# Altium schematic sheet main.SchDoc
size A4; SheetNumber: 1; SheetTotal: 1
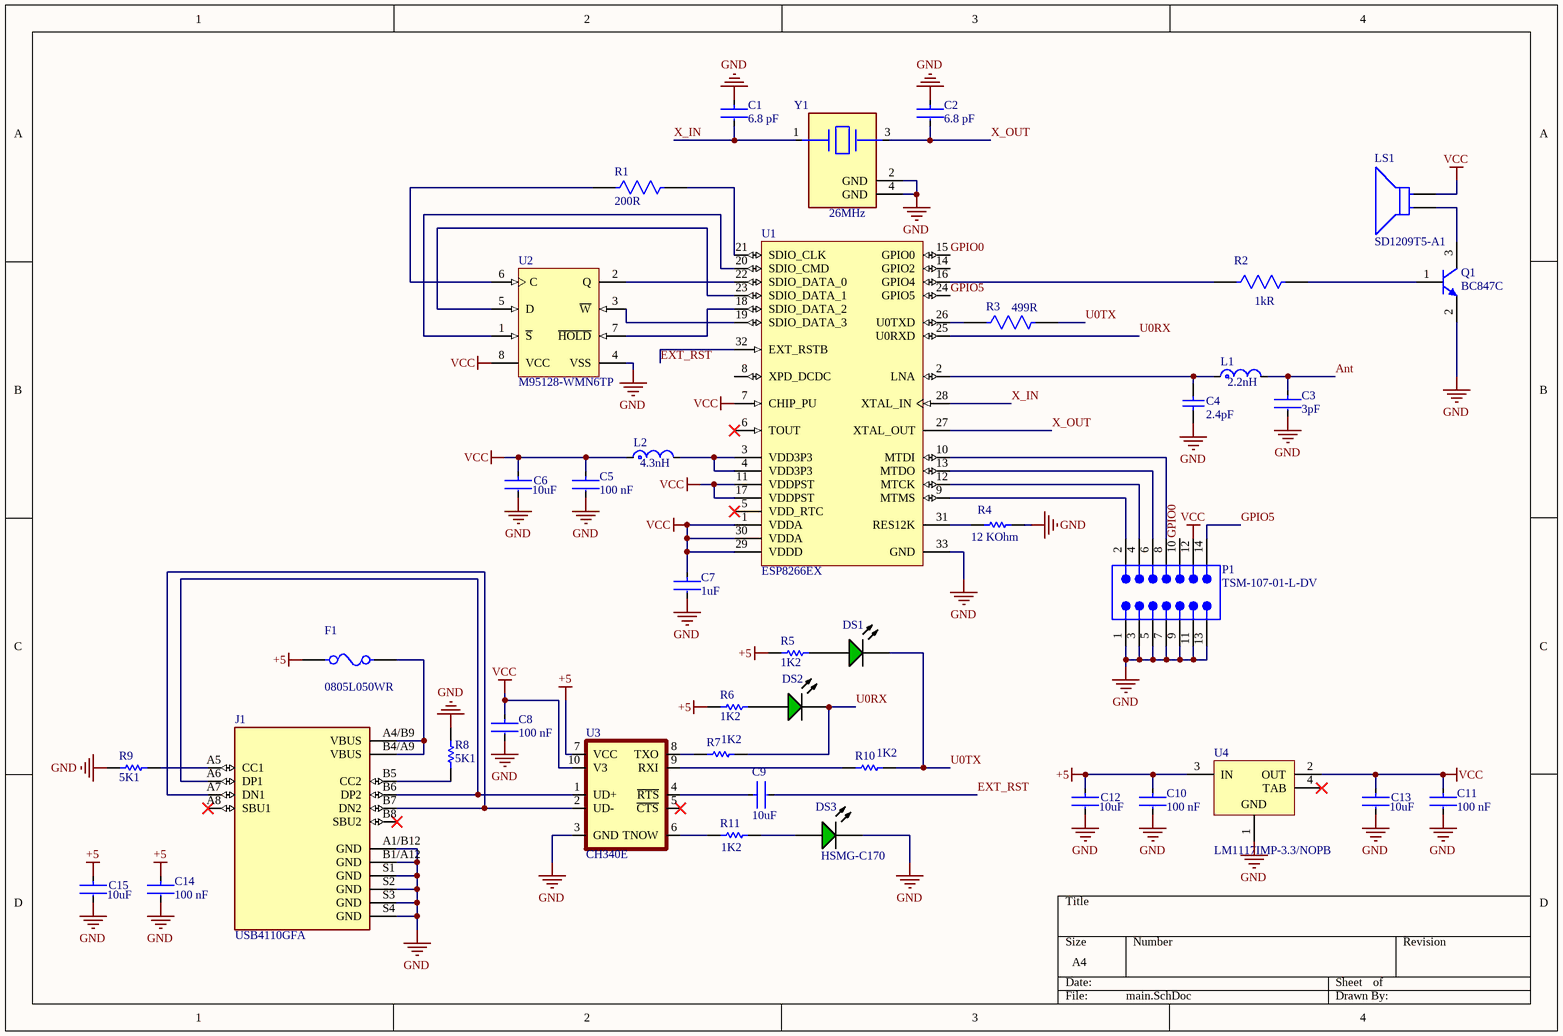
[diagram p0: main.SchDoc]

## Parts
C1  Capacitance: 6.8 pF  [FP-C0402-BB-MFG]  (hidden comment: C0402C689C5GACTU)
C2  Capacitance: 6.8 pF  [FP-C0402-BB-MFG]  (hidden comment: C0402C689C5GACTU)
C3  Capacitance: 3pF  [FP-GJM155-0_05-IPC_C]  (hidden comment: GJM1555C1H3R0BB01D)
C4  2.4pF  [CAPC1006X50X20ML10T10]
C5  value 100 nF  [FP-CC0402-MFG]  (hidden comment: CC0402KRX7R9BB104)
C6  Capacitance: 10uF  [FP-C1608-080-0_1-MFG]  (hidden comment: C1608X5R1A106K080AC)
C7  value 1uF  [FP-GRM15-0_1-MFG]  (hidden comment: GRM155R61A105KE15D)
C8  value 100 nF  [FP-CC0402-MFG]  (hidden comment: CC0402KRX7R9BB104)
C9  Capacitance: 10uF  [FP-C1608-080-0_1-MFG]  (hidden comment: C1608X5R1A106K080AC)
C10  value 100 nF  [FP-CC0402-MFG]  (hidden comment: CC0402KRX7R9BB104)
C11  value 100 nF  [FP-CC0402-MFG]  (hidden comment: CC0402KRX7R9BB104)
C12  Capacitance: 10uF  [FP-C1608-080-0_1-MFG]  (hidden comment: C1608X5R1A106K080AC)
C13  Capacitance: 10uF  [FP-C1608-080-0_1-MFG]  (hidden comment: C1608X5R1A106K080AC)
C14  value 100 nF  [FP-CC0402-MFG]  (hidden comment: CC0402KRX7R9BB104)
C15  Capacitance: 10uF  [FP-C1608-080-0_1-MFG]  (hidden comment: C1608X5R1A106K080AC)
DS1  HSMG-C170  [AVAG-HSMX-C170_V]  (value not drawn)
DS2  HSMG-C170  [AVAG-HSMX-C170_V]  (value not drawn)
DS3  HSMG-C170  [AVAG-HSMX-C170_V]
F1  0805L050WR  [FP-0805L-MFG]
J1  USB4110GFA  [GCT_USB4110GFA]
L1  Inductance: 2.2nH  [FP-LQG15HH_02-IPC_C]  (hidden comment: LQG15HN2N2S02D)
L2  Inductance: 4.3nH  [FP-LQG15HH_02-MFG]  (hidden comment: LQG15HN4N3S02D)
LS1  SD1209T5-A1  [FP-SD1209-MFG]
P1  TSM-107-01-L-DV  [SMTC-TSM-107-01-X-DV]
Q1  BC847C  [INF-SOT23_L]
R1  Resistance: 200R  [FP-CRCW0402-e3-IPC_C]  (hidden comment: CRCW0402200RFKED)
R2  Resistance: 1kR  [FP-ERA3A-IPC_C]  (hidden comment: ERA-3AEB102V)
R3  Resistance: 499R  [FP-RC0402-0_4-IPC_A]  (hidden comment: RC0402FR-07499RL)
R4  Resistance: 12 KOhm  [RESC1005X40X25ML05T05]  (hidden comment: ERJ-2RKF1202X)
R5  1K2  [RESC1005X40X25NL05T05]
R6  1K2  [RESC1005X40X25NL05T05]
R7  1K2  [RESC1005X40X25NL05T05]
R8  5K1  [RESC1608X55X25ML10T15]
R9  5K1  [RESC1608X55X25ML10T15]
R10  1K2  [RESC1005X40X25NL05T05]
R11  1K2  [RESC1005X40X25NL05T05]
U1  ESP8266EX  [ESFS-QFN-32_L]
U2  M95128-WMN6TP  [STM-SO8N-8_V]
U3  CH340E  [MSOP10]
U4  LM1117IMP-3.3/NOPB  [DCY0004A_N]
Y1  Frequency: 26MHz  [FP-ABM11-MFG]  (hidden comment: ABM11-26.000MHZ-B7G-T)

## Nets
+5: C10.1 C12.2 C14.1 C15.2 F1.1 R5.2 R6.2 U3.7(VCC) U4.3(IN)
GND: C1.1 C2.1 C3.2 C4.2 C5.2 C6.1 C7.2 C8.2 C10.2 C11.2 C12.1 C13.1 C14.2 C15.1 DS3.2(K) J1.A1/B12(GND) J1.B1/A12(GND) J1.S1(GND) J1.S2(GND) J1.S3(GND) J1.S4(GND) P1.1 P1.3 P1.5 P1.7 P1.9 P1.11 P1.13 Q1.2(E) R4.2 R8.2 R9.1 U1.33(GND) U2.4(VSS) U3.3(GND) U4.1(GND) Y1.2(GND) Y1.4(GND)
VCC: C5.1 C6.2 C7.1 C8.1 C11.1 C13.2 L2.1 LS1.2(A) P1.12 U1.1(VDDA) U1.7(CHIP_PU) U1.11(VDDPST) U1.17(VDDPST) U1.29(VDDD) U1.30(VDDA) U2.8(VCC) U3.10(V3) U4.2(OUT)
Ant: C3.1 L1.2
EXT_RST: C9.1 U1.32(EXT_RSTB)
GPIO0: P1.10 U1.15(GPIO0)
GPIO5: P1.14 U1.24(GPIO5)
U0RX: DS2.2(K) R7.2 U1.25(U0RXD)
U0TX: DS1.2(K) R3.2 R10.2
X_IN: C1.2 U1.28(XTAL_IN) Y1.1
X_OUT: C2.2 U1.27(XTAL_OUT) Y1.3
NetC4_1: C4.1 L1.1 U1.2(LNA)
NetC9_2: C9.2 U3.4(~{RTS})
NetDS1_1: DS1.1(A) R5.1
NetDS2_1: DS2.1(A) R6.1
NetDS3_1: DS3.1(A) R11.2
NetF1_2: F1.2 J1.A4/B9(VBUS) J1.B4/A9(VBUS)
NetJ1_A5: J1.A5(CC1) R9.2
NetJ1_A6: J1.A6(DP1) J1.B6(DP2) U3.1(UD+)
NetJ1_A7: J1.A7(DN1) J1.B7(DN2) U3.2(UD-)
NetJ1_B5: J1.B5(CC2) R8.1
NetL2_2: L2.2 U1.3(VDD3P3) U1.4(VDD3P3)
NetLS1_1: LS1.1(C) Q1.3(C)
NetP1_2: P1.2 U1.9(MTMS)
NetP1_4: P1.4 U1.12(MTCK)
NetP1_6: P1.6 U1.13(MTDO)
NetP1_8: P1.8 U1.10(MTDI)
NetQ1_1: Q1.1(B) R2.2
NetR1_1: R1.1 U2.6(C)
NetR1_2: R1.2 U1.21(SDIO_CLK)
NetR2_1: R2.1 U1.16(GPIO4)
NetR3_1: R3.1 U1.26(U0TXD)
NetR4_1: R4.1 U1.31(RES12K)
NetR7_1: R7.1 U3.8(TXO)
NetR10_1: R10.1 U3.9(RXI)
NetR11_1: R11.1 U3.6(TNOW)
NetU1_18: U1.18(SDIO_DATA_2) U2.7(~{HOLD})
NetU1_19: U1.19(SDIO_DATA_3) U2.3(~{W})
NetU1_20: U1.20(SDIO_CMD) U2.1(~{S})
NetU1_22: U1.22(SDIO_DATA_0) U2.2(Q)
NetU1_23: U1.23(SDIO_DATA_1) U2.5(D)

Not connected (* = marked no-connect by the designer): J1 A8(SBU1)* B8(SBU2)*; U1 5(VDD_RTC)* 6(TOUT)* 8(XPD_DCDC) 14(GPIO2); U3 5(~{CTS})*; U4 4(TAB)*

## Library data of the parts
C1 C2 = CMP-1034-00517-3: CAP CER 6.8PF 50V NP0 0402; Manufacturer: Kemet; Material: Ceramic; Temperature Characteristic: C0G; Tolerance: 0.25 pF; Temperature Coefficient: 15%; ComponentLink2URL: https://content.kemet.com/datasheets/KEM_C1002_X7R_SMD.pdf; Octopart: https://octopart.com/c0402c689c5gactu-kemet-9143567; RoHS: TRUE; Temperature: -55°C to +125°C; Device Class L2: Capacitors; ComponentLink2Description: Datasheet; Mouser Description: Cap Ceramic 6.8pF 50V C0G 0.25pF SMD 0402 125°C Paper T/R; Device Class L3: Ceramic Capacitors; Digikey Description: CAP CER 6.8PF 50V NP0 0402; Temperature Range High: +125°C; Package: C0402-BB; Voltage Rating: 50 V; Height: 0.55mm; Ipc Land Pattern Name: CAPC10050X50; Value: 6.8 pF; Device Class L1: Passive Components; Category: Cap; Manufacturer Part Number: C0402C689C5GACTU; Lead Free: Yes; Automotive: No; Temperature Range Low: -55°C
C3 = CMP-2008-03843-2: Multi-Layer Ceramic Capacitor 3pF C0G  ±0.1pF 0402 Paper T/R; Voltage Rating: 50V; Termination: SMD/SMT; Package Quantity: 1; Packaging: Tape and Reel; REACH SVHC: No SVHC; Case Code (Metric): 1005; Dielectric: C0G; Voltage: 50V; Max Operating Temperature: 125°C; Depth: 0.5mm; Min Operating Temperature: -55°C; Case/Package: 0402; Lead Free: Lead Free; Width: 0.02inch; Thickness: 0.022inch; Radiation Hardening: No; Length: 1mm; Height: 0.5mm; Voltage Rating (DC): 50V; Mount: Surface Mount; Case Code (Imperial): 0402
C4 = CMP-2008-04784-1: Part Number: 04023J2R4BBSTR; Manufacturer: AVX Interconnect / Elco
C5 C8 C10 C11 C14 = CMP-03422-001010-1: CAP CER 0.1UF 50V X7R 0402; Manufacturer: YAGEO; Temperature Coefficient: 30ppm/°C; Material: Ceramic; Automotive Grade: NA; Tolerance: 0.1; Footprint Url: http://www.yageo.com/exep/pages/download/literatures/UPY-C_GEN_24.pdf; Category: Cap; Capacitance: 100 nF; Package: CC0402; Voltage Rating: 50 V; ComponentLink2Description: Datasheet; Temperature Characteristic: X7R; Device Class L1: Passive Components; Device Class L2: Capacitors; Digikey Description: CAP CER 0.1UF 50V X7R 0402; Octopart: https://octopart.com/cc0402krx7r9bb104-yageo-56536067; Device Class L3: Ceramic Capacitors; Height: 0.55mm; Temperature: -55°C to +125°C; Temperature Range High: +125°C; ComponentLink2URL: http://www.yageo.com/documents/recent/UPY-GP_NP0_16V-to-50V_16.pdf; Temperature Range Low: -55°C; RoHS: TRUE; Ipc Land Pattern Name: CAPC10050X50; Lead Free: Yes; Automotive: No; Manufacturer Part Number: CC0402KRX7R9BB104
C6 C9 C12 C13 C15 = CMP-2000-04979-3: Multilayer Ceramic Capacitors 10μF ±10% 10V X5R SMD 0603; Dielectric Material: Ceramic; Construction: Flat; Height: 0.8mm; Thickness: 0.035inch; Case Code (Metric): 1608; Radiation Hardening: No; Number of Pins: 2; Voltage Rating (DC): 10V; Depth: 0.8mm; Voltage: 10V; RoHS Compliant: Yes; Voltage Rating: 10V; Package Quantity: 1; Resistor Type: Ceramic; Termination: SMD/SMT; Lead Free: Lead Free; REACH SVHC: No SVHC; Tolerance: 10%; Mount: Surface Mount; Series: C; Packaging: Tape and Reel; Width: 0.8mm; Dielectric: X5R; Weight: 7.1E-05oz; Length: 1.6mm; Max Operating Temperature: 85°C; Case Code (Imperial): 0603; Case/Package: 0603; Min Operating Temperature: -55°C
C7 = CMP-2008-04556-2: CAP CER 1UF 10V X5R 0402; Manufacturer: Murata; Material: Ceramic; Tolerance: 10%; Temperature Coefficient: 15%; Octopart: https://octopart.com/grm155r61a105ke15d-murata-197442; Manufacturer Part Number: GRM155R61A105KE15D; Lead Free: Yes; ComponentLink2Description: Datasheet; Temperature: -55°C to +85°C; Temperature Range High: +85°C; Height: 0.55mm; Capacitance: 1uF; Ipc Land Pattern Name: CAPC10050X50; ComponentLink2URL: https://search.murata.co.jp/Ceramy/image/img/A01X/G101/ENG/GRM155R61A105KE15-01A.pdf; Temperature Range Low: -55°C; Device Class L2: Capacitors; Voltage Rating: 10V; RoHS: TRUE; Device Class L1: Passive Components; Device Class L3: Ceramic Capacitors; Temperature Characteristic: X5R; Mouser Description: 0402 1 uF 10 V ±10% Tolerance X5R Surface Mount Multilayer Ceramic Capacitor; Automotive: No; Package: GRM15-0.1; Digikey Description: CAP CER 1UF 10V X5R 0402; Category: Cap
DS1-DS3 = CMP-2000-05062-1: Chip LED, Green, 2.2 V, -40 to 85 degC, 2-Pin SMD, Pb-Free, Tape and Reel; Manufacturer: Avago; No. of Pins: 2; Peak Wavelength: 570nm; SVHC: NoSVHC(16-Jun-2014); Dominant Wavelength: 572nm; Forward Current If: 20mA; Viewing Angle: 170deg; Lens Shape: Rectangular; PIV Max: 5V; External Width: 1.25mm; LED Type: Standard; External Depth: 0.8mm; Opto Mounting Orientation: Top; Luminous Intensity: 15mcd; Luminous Intensity Min: 4mcd; Forward Voltage VF Max: 2.6V; External Length / Height: 2mm; Bulb Size: 1.25mmx1.4mm; Light Area Height: 1mm; Voltage Vf Typ: 2.2V; Operating Temperature Max: 85degC; Datasheet Version: Oct-08; MSL: MSL2A-4weeks; Peak Forward Current: 20mA; Package Description: 2-Pin Surface Mount Device, Body 2 x 1.25 mm, Height 0.8 mm; Datasheet URL: https://datasheet.ciiva.com/29280/180495-da-01-en-chip-led-hsmg-c170-gelb-gruen-29280971.pdf; Storage Temperature Min: -40degC; LED Colour: Green; Wavelength Typ: 570nm; Mounting Type: SMD; Forward Current If Max: 20mA; Dominant Wavelength Typ: 572nm; LED Mounting: SMD; Operating Temperature Range: -30degCto+85degC; Operating Temperature Min: -30degC; Manufacturer URL: http://www.avagotech.com/; Packaging: CutTape; Luminous Intensity Typ: 15mcd; Package Reference: HSMX-C170; Storage Temperature Max: 85degC; Opto Case Style: SMD; Forward Voltage: 2.2V
F1 = CMP-08606-000023-1: PTC RESET FUSE 6V 500MA 0805; Manufacturer: Littelfuse Inc.; Current Rating: 100A; Hold Current: 0.5A; Value: 0.15-0.85Ω; Trip Time: 0.1s; Trip Current: 1A; Device Class L2: PTC Resettable Fuses; Manufacturer Part Number: 0805L050WR; Digikey Description: PTC RESET FUSE 6V 500MA 0805; ComponentLink2URL: https://www.littelfuse.com/~/media/electronics/datasheets/resettable_ptcs/littelfuse_ptc_0805l_datasheet.pdf.pdf; Package: 0805L; RoHS: TRUE; Temperature Range Low: -40°C; Octopart: https://octopart.com/0805l050wr-littelfuse-673858; Resistance: 0.15-0.85Ω; ComponentLink2Description: Datasheet; Category: Fuse; Height: 1.25mm; Mouser Description: PTC Resettable Fuse 0.5A(hold) 1A(trip) 6VDC 100A 0.5W 0.1s 0.15Ohm SMD Solder Pad 0805 T/R; Ambient Temperature Range High: +85°C; Automotive: No; Device Class L3: unset; Lead Free: Yes; Temperature: -40°C to +85°C; Voltage Rating: 6V; Ambient Temperature Range Low: -40°C; Temperature Range High: +85°C; Device Class L1: Circuit Protection
J1 = USB4110GFA: 0PCS TYPE-C-04 / https://aliexpress.ru/item/1005005371954812.html?sku_id=12000032786473722&spm=a2g2w.productlist.search_results.6.6aa66f78vHu0s1; MF: Global Connector Technology; SnapEDA_Link: https://www.snapeda.com/parts/USB4110GFA/Global+Connector+Technology/view-part/?ref=snap; Package: None; Value: *; MP: USB4110GFA; Check_prices: https://www.snapeda.com/parts/USB4110GFA/Global+Connector+Technology/view-part/?ref=eda
L1 = CMP-1662-00024-2: Multilayer type RF Inductor 2.2nH ±0.3nH 0.09Ω 900mA 0402; Test Frequency: 100MHz; Core Material: Air; DC Resistance (DCR): 150mR; Q Factor: 8; Shielding: Unshielded; Self Resonant Frequency: 6GHz; Current Rating: 300mA; Lead Free: Lead Free; Military Standard: Not; Case Code (Imperial): 0402; Case Code (Metric): 1005; Min Operating Temperature: -55°C; Width: 0.02inch; Depth: 0.55mm; Length: 1mm; REACH SVHC: No SVHC; Height - Seated (Max): 0.022inch; Case/Package: 0402; Height: 0.02inch; Package Quantity: 10000; Packaging: Tape and Reel; Mount: Surface Mount; Max DC Current: 300mA; Number of Pins: 2; Max Operating Temperature: 125°C; Termination: SMD/SMT; DC Current: 300mA; Radiation Hardening: No
L2 = CMP-06042-008580-1: Multilayer type RF Inductor 4.3nH ±0.3nH 0.15Ω 700mA 0402; Shielding: Unshielded; Test Frequency: 100MHz; Current: 300mA; DC Resistance (DCR): 210mR; Self Resonant Frequency: 6GHz; Core Material: Air; Q Factor: 8; Case Code (Imperial): 0402; Military Standard: Not; Case Code (Metric): 1005; Termination: SMD/SMT; Width: 0.02inch; Height - Seated (Max): 0.022inch; REACH SVHC: No SVHC; Package Quantity: 10000; Length: 1.05mm; Case/Package: 0402; Height: 0.5mm; Max Operating Temperature: 125°C; Depth: 0.55mm; Min Operating Temperature: -55°C; Mount: Surface Mount; Max DC Current: 300mA; DC Current: 300mA; Radiation Hardening: No; Current Rating: 300mA; Lead Free: Lead Free; Packaging: Tape and Reel
LS1 = CMP-08413-000009-1: AUDIO MAGNETIC XDCR 3-6V TH; Max Supply Current: 60mA; Number of Terminals/Pins: 2; Frequency: 2.048kHz; Washable: No; Operating Supply Voltage: 5V; Self Resonant Frequency: 2.05kHz; Min Operating Temperature: -40°C; Operating Supply Current: 60mA; Diameter: 12mm; Package Quantity: 100; Max Operating Temperature: 85°C; Sensing Method: Magnetic; Series: SD; Current Rating: 60mA; Lead Free: Lead Free; Height: 9mm; Packaging: Tray; Termination: PC Pins; Number of Pins: 2; Voltage Rating (DC): 5V; Mount: Through Hole
P1 = CMP-1024-00260-1: 0.025" SQ Post Header, Surface Mount, Vertical, -55 to 125 degC, 2.54 mm Pitch, 14-Pin, Male, RoHS; Manufacturer: Samtec; Pitch: 2.54 mm; RoHS: True; PackageVersion: DJ, 4/1991; ComponentLink1Description: Manufacturer URL; ComponentLink3URL: http://www.samtec.com/documents/webfiles/cpdf/TSM-1XX-XX-XXX-XX-X-XXX-X-MKT.pdf; ComponentLink2Description: Datasheet; Orientation: Vertical; Mounting Technology: Surface Mount; ComponentLink2URL: http://www.samtec.com/documents/webfiles/pdf/TSM.PDF; PackageDescription: Double Row Gullwing ASM; DatasheetVersion: F-214; PackageReference: TSM-107-01-X-DV; ComponentLink1URL: http://www.samtec.com; ComponentLink3Description: Package Specification; PartNumber: TSM-107-01-L-DV; Temperature Range: -55 to 125 degC
Q1 = CMP-1177-00037-1: NPN Silicon AF Transistor, 45 V VCEO, 100 mA IC, SOT23, Reel, Green; Manufacturer: Infineon; VCEO (max): 45Â V; VEBO (max): 6Â V; fT (typ): 250Â MHz; VCBO (max): 50Â V; ICM (max): 200Â mA; Green: TRUE; IC (max): 100Â mA; Ptot (max): 330Â mW; ICBO (max): 15Â nA; PartNumber: BC847C; ComponentLink3URL: http://www.infineon.com/dgdl/SOT23-Package_Overview.pdf?folderId=db3a30431936bc4b0119532290053c66&fileId=db3a30431936bc4b0119533468123c85; ComponentLink3Description: Package Specification; Mounting Technology: Surface Mount; PackageDescription: 3-Pin Small Outline Transistor Package, 1.3 x 2.9 mm Body, 0.95 mm Pitch; PackageReference: SOT23; ComponentLink2URL: http://www.infineon.com/dgdl/bc847series_bc848series_bc849series_bc850series.pdf?folderId=db3a304314dca389011541d30fa21656&fileId=db3a304314dca389011541d4630a1657; ComponentLink2Description: Datasheet; ComponentLink1Description: Manufacturer URL; Polarity: NPN; ComponentLink1URL: http://www.infineon.com/; IBM (max): 200Â mA; Packing: Reel; PackageVersion: Apr-08
R1 = CMP-1011-00429-3: RES Thick Film, 200Ω, 1%, 0.063W, 100ppm/°C, 0402; Max Power Dissipation: 63mW; Voltage Rating: 50V; Termination: SMD/SMT; Weight: 2.3E-05oz; Case/Package: 0402; Contact Plating: Tin; Number of Pins: 2; Width: 0.5mm; Height: 0.35mm; Case Code (Metric): 1005; Military Standard: Not; Features: Automotive AEC-Q200; Power Rating: 63mW; Temperature Coefficient: 100ppm/°C; Tolerance: 1%; Lead Free: Lead Free; Depth: 0.5mm; Max Operating Temperature: 155°C; Min Operating Temperature: -55°C; Package Quantity: 10; Voltage Rating (DC): 50V; Composition: Thick Film; Mount: Surface Mount; Radiation Hardening: No; Length: 1mm; Packaging: Tape and Reel; Number of Terminations: 2; Case Code (Imperial): 0402
R2 = CMP-2000-00873-2: RES SMD 1K OHM 0.1% 1/10W 0603; Temperature Coefficient: 25ppm/°C; Voltage Rating: 75V; Max Power Dissipation: 100mW; Technology: METAL FILM; Number of Pins: 2; Packaging: Tape and Reel; Case Code (Imperial): 0603; Case Code (Metric): 1608; Min Operating Temperature: -55°C; REACH SVHC: No SVHC; Length: 1.6mm; Termination: SMD/SMT; Depth: 0.8mm; Resistance Tolerance: 0.1%; Number of Terminations: 2; Width: 0.8mm; Military Standard: Not; Tolerance: 0.1%; Package Quantity: 5000; Contact Plating: Tin; Height: 0.45mm; Construction: Rectangular; Case/Package: 0603; Max Operating Temperature: 155°C; Resistor Type: Thin Film; Series: ERA-3A; Size Code: 0603; RoHS Compliant: Yes; Mount: Surface Mount; Radiation Hardening: No; Power Rating: 100mW
R3 = CMP-2002-07708-2: RES 499 OHM 1% 1/16W 0402; Power Rating: 62.5mW; Voltage Rating: 50V; Max Power Dissipation: 63mW; Temperature Coefficient: 100ppm/°C; Width: 0.02inch; Resistance Tolerance: 1%; Package Quantity: 1; Military Standard: Not; Resistor Type: Thick Film; Height: 0.016inch; Features: Moisture Resistant; Lead Free: Lead Free; Case Code (Metric): 1005; Series: RC; REACH SVHC: No SVHC; Packaging: Tape and Reel; Depth: 0.5mm; Size Code: 0402; Min Operating Temperature: -55°C; Voltage Rating (DC): 50V; Max Operating Temperature: 155°C; Termination: SMD/SMT; Length: 0.039inch; RoHS Compliant: Yes; Case Code (Imperial): 0402; Construction: Rectangular; Number of Terminations: 2; Tolerance: 1%; Case/Package: 0402
R4 = CMP-2002-00646-4: Chip Resistor, 12 KOhm, +/- 1%, 0.1 W, -55 to 155 degC, 0402 (1005 Metric), RoHS, Tape and Reel; Voltage Rating: 50 V; Case\/Package: 0402; Power Rating: 100 mW; Length: 1 mm; PackageReference: 0402; DatasheetVersion: 04/2015; ComponentLink2Description: Datasheet; ComponentLink1URL: http://www.panasonic.com/; Pins: 2; Width: 0.5 mm; REACH SVHC: Yes; Packaging: Tape and Reel; Min Operating Temperature: -55 degC; Mounting Technology: Surface Mount; Max Operating Temperature: 155 degC; Case Code (Imperial): 0402; Height: 0.35 mm; Tolerance: 1%; PackageDescription: 2-Pin Surface Mount Device, Body 1 x 0.5 mm; RoHSCompliant: true; ComponentLink1Description: Manufacturer URL; Mount: Surface Mount; ComponentLink2URL: http://industrial.panasonic.com/cdbs/www-data/pdf/RDA0000/AOA0000C86.pdf; Package Quantity: 10000; Case Code (Metric): 1005; PartNumber: ERJ-2RKF1202X
R5-R7 R10 R11 = CMP-2002-08284-1: Part Number: CRCW04021K20FKED; Manufacturer: Vishay Dale
R8 R9 = CMP-2000-04091-1: Manufacturer: Yageo; Part Number: RC0603FR-075K1L
U1 = CMP-2000-07453-1: Low-Power, Highly-Integrated Wi-Fi Solution, 2.5 to 3.6 V, 80 mA, -40 to 125 degC, 32-Pin QFN; Manufacturer: Espressif Systems; Mounting Technology: SurfaceMount; Datasheet URL: http://espressif.com/sites/default/files/documentation/0a-esp8266ex_datasheet_en.pdf; Package Reference: QFN-32; Package Description: 32-Pin Quad Falt No-Lead, Body 5 x 5 mm, Pitch 0.5 mm; Manufacturer URL: http://espressif.com; Datasheet Version: Rev. 5.4, 04/2017
U2 = CMP-2000-06648-1: SPI Bus EEPROM with High-Speed Clock, 128 Kbit, 2.5 to 5.5 V, -40 to 85 degC, 8-Pin SOIC, RoHS, Tape and Reel; Manufacturer: STMicroelectronics; Write Protection: Yes; Organization: 16Kx8; Frequency: 5MHz; Interface Type: Serial(SPI); Operating Supply Voltage (Max): 5.5V; Access Time (Max): 60ns; Data Retention: 200; Density: 131072Bit; Rad Hardened: No; Operating Supply Voltage (Typ): 3.3/5V; Operating Supply Voltage (Min): 2.5V; Supply Current: 5mA; Packaging: TapeandReel; Package Type: SON; Pin Count: 8; Datasheet URL: http://www.st.com/content/ccc/resource/technical/document/datasheet/11/47/cf/4a/88/23/42/87/CD00001441.pdf/files/CD00001441.pdf/jcr:content/translations/en.CD00001441.pdf; Package Reference: SO8N; Mounting Technology: SurfaceMount; Operating Temperature (Min): -40C; Operating Temperature Classification: Industrial; Programmable: Yes; Operating Temperature (Max): 85C; Datasheet Version: Rev. 17 , 05/2015; Mounting: SurfaceMount; Operating Temp Range: -40Cto85C; Package Description: 8-Pin Small Outline Integrated Circuit, Body 4.9 x 3.9 mm, Pitch 1.27 mm; Manufacturer URL: http://www.st.com/
U3 = CH340E: USB to serial chip CH340; MF: WCH; SnapEDA_Link: https://www.snapeda.com/parts/CH340E/WCH/view-part/?ref=snap; Package: Package; Value: *; MP: CH340E; Check_prices: https://www.snapeda.com/parts/CH340E/WCH/view-part/?ref=eda
U4 = CMP-0062-01631-4: 800mA Low-Dropout Linear Regulator, 4-pin SOT-223, Pb-Free; Manufacturer: Texas Instruments; PackageTopMarking: XYTT*N05B; PowerWise: N; High-Reliability: Y; CompType: LDO IC; Code_IPC: SOT223-4; PackageReference: DCY0004A; PinCount: 4; PackageDescription: Molded SOT-223, 6.50 x 3.56 x 1.6mm Body, 4 Lead, 2.3mm Pitch; PartNumber: LM1117IMP-3.3/NOPB; RoHS: Y; ComponentLink1Description: Datasheet URL; Code_JEDEC: TO-261-AA; ComponentLink1URL: http://www.ti.com/general/docs/lit/getliterature.tsp?genericPartNumber=LM1117-N&fileType=pdf
Y1 = CMP-27762-005749-1: Crystal 26MHz ±15ppm 10pF SMD-4 2mm x 1.6mm; Series Resistance: 100R; Case/Package: CSMD; Length: 2mm; Max Operating Temperature: 70°C; Packaging: Tape and Reel; Package Quantity: 1000; Frequency Tolerance: 15ppm; Mount: Surface Mount; Width: 0.063inch; ESR (Equivalent Series Resistance): 100R; Number of Pins: 4; Operating Frequency: 26 MHz; Min Operating Temperature: -20°C; Series: ABM11; Height: 0.023inch; Load Capacitance: 10pF; Lead Free: Lead Free; Tolerance: 15ppm; REACH SVHC: No SVHC; Depth: 1.6mm; Frequency Stability: 15ppm; Termination: SMD/SMT